# EAGLE schematic schema_siege (EAGLE 9.2.2)
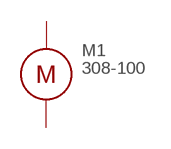
[diagram p0: schematic, sheet 1]

## Parts
M1  308-100  [308-100]
Unconnected: M1.NEG M1.POS

## Library data of the parts
M1 = motor:308-100: Pico Vibe 8mm Vibration Motor - 3mm Type; PRECISION_MICRODRIVES: 308-100